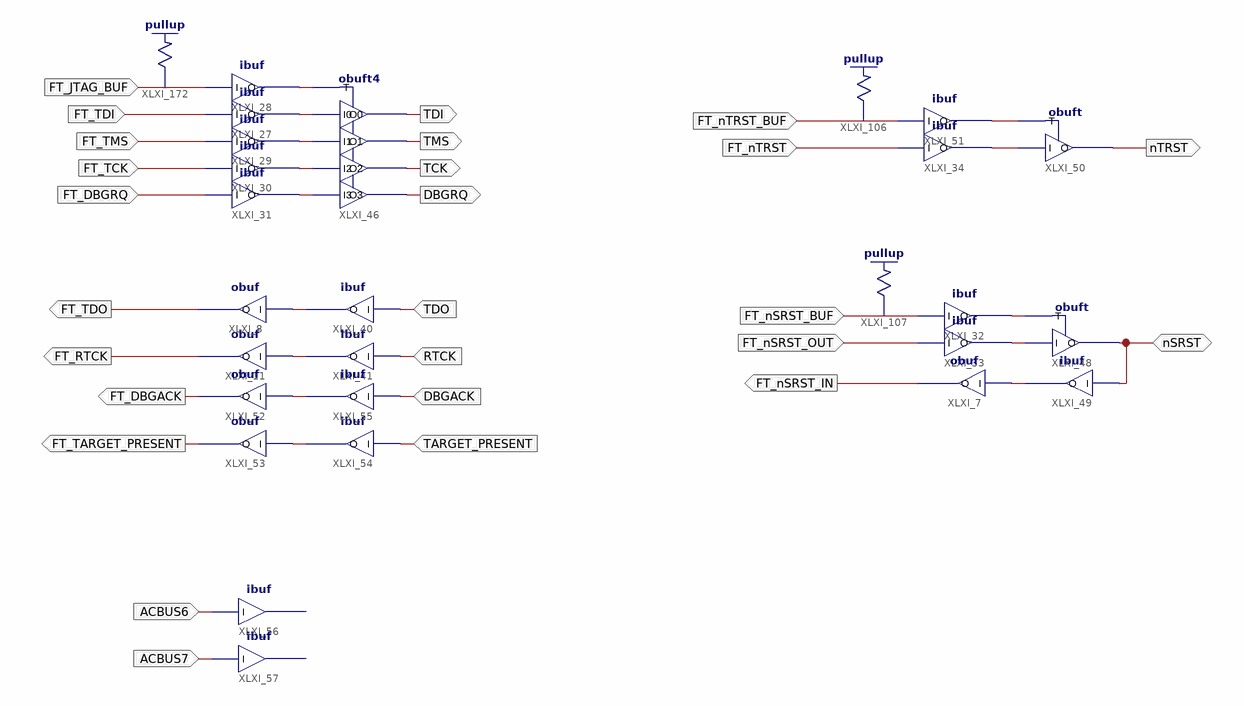
[diagram p0: schematic sheet 1]
// Xilinx ISE schematic BBv2JTAGKEY.sch (acr2) as structural Verilog: 27 symbols, 26 ports
module BBv2JTAGKEY (
  input  ACBUS6,
  input  ACBUS7,
  input  FT_nSRST_BUF,
  input  FT_nSRST_OUT,
  input  FT_nTRST,
  input  FT_nTRST_BUF,
  input  TDO,
  input  RTCK,
  input  DBGACK,
  input  TARGET_PRESENT,
  input  FT_JTAG_BUF,
  input  FT_TMS,
  input  FT_TCK,
  input  FT_DBGRQ,
  input  FT_TDI,
  inout  nSRST,
  output FT_nSRST_IN,
  output nTRST,
  output FT_TDO,
  output FT_RTCK,
  output FT_DBGACK,
  output FT_TARGET_PRESENT,
  output TDI,
  output TCK,
  output DBGRQ,
  output TMS
);

  wire XLXN_39, XLXN_41, XLXN_43, XLXN_44, XLXN_45, XLXN_47, XLXN_48, XLXN_50, XLXN_52, XLXN_54, XLXN_55,
       XLXN_61, XLXN_62, XLXN_63;

  ibuf XLXI_56 (.I(ACBUS6));  // open: O
  ibuf XLXI_57 (.I(ACBUS7));  // open: O
  ibuf XLXI_49 (.I(nSRST), .O(XLXN_50));
  obuft XLXI_48 (.I(XLXN_48), .T(XLXN_47), .O(nSRST));
  ibuf XLXI_32 (.I(FT_nSRST_BUF), .O(XLXN_47));
  ibuf XLXI_33 (.I(FT_nSRST_OUT), .O(XLXN_48));
  obuf XLXI_7 (.I(XLXN_50), .O(FT_nSRST_IN));
  obuft XLXI_50 (.I(XLXN_52), .T(XLXN_61), .O(nTRST));
  ibuf XLXI_34 (.I(FT_nTRST), .O(XLXN_52));
  ibuf XLXI_51 (.I(FT_nTRST_BUF), .O(XLXN_61));
  \pullup  XLXI_106 (.O(FT_nTRST_BUF));
  \pullup  XLXI_107 (.O(FT_nSRST_BUF));
  ibuf XLXI_41 (.I(RTCK), .O(XLXN_55));
  obuf XLXI_11 (.I(XLXN_55), .O(FT_RTCK));
  obuf XLXI_52 (.I(XLXN_63), .O(FT_DBGACK));
  obuf XLXI_53 (.I(XLXN_62), .O(FT_TARGET_PRESENT));
  ibuf XLXI_54 (.I(TARGET_PRESENT), .O(XLXN_62));
  ibuf XLXI_55 (.I(DBGACK), .O(XLXN_63));
  obuf XLXI_8 (.I(XLXN_54), .O(FT_TDO));
  ibuf XLXI_40 (.I(TDO), .O(XLXN_54));
  ibuf XLXI_28 (.I(FT_JTAG_BUF), .O(XLXN_39));
  ibuf XLXI_27 (.I(FT_TDI), .O(XLXN_41));
  ibuf XLXI_29 (.I(FT_TMS), .O(XLXN_43));
  ibuf XLXI_30 (.I(FT_TCK), .O(XLXN_44));
  ibuf XLXI_31 (.I(FT_DBGRQ), .O(XLXN_45));
  obuft4 XLXI_46 (
    .I0(XLXN_41), .I1(XLXN_43), .I2(XLXN_44), .I3(XLXN_45), .T(XLXN_39), .O0(TDI), .O1(TMS), .O2(TCK),
    .O3(DBGRQ));
  \pullup  XLXI_172 (.O(FT_JTAG_BUF));
endmodule
